# Altium schematic sheet Clocking_and_LO.SchDoc
size C; SheetNumber: 6; SheetTotal: 15
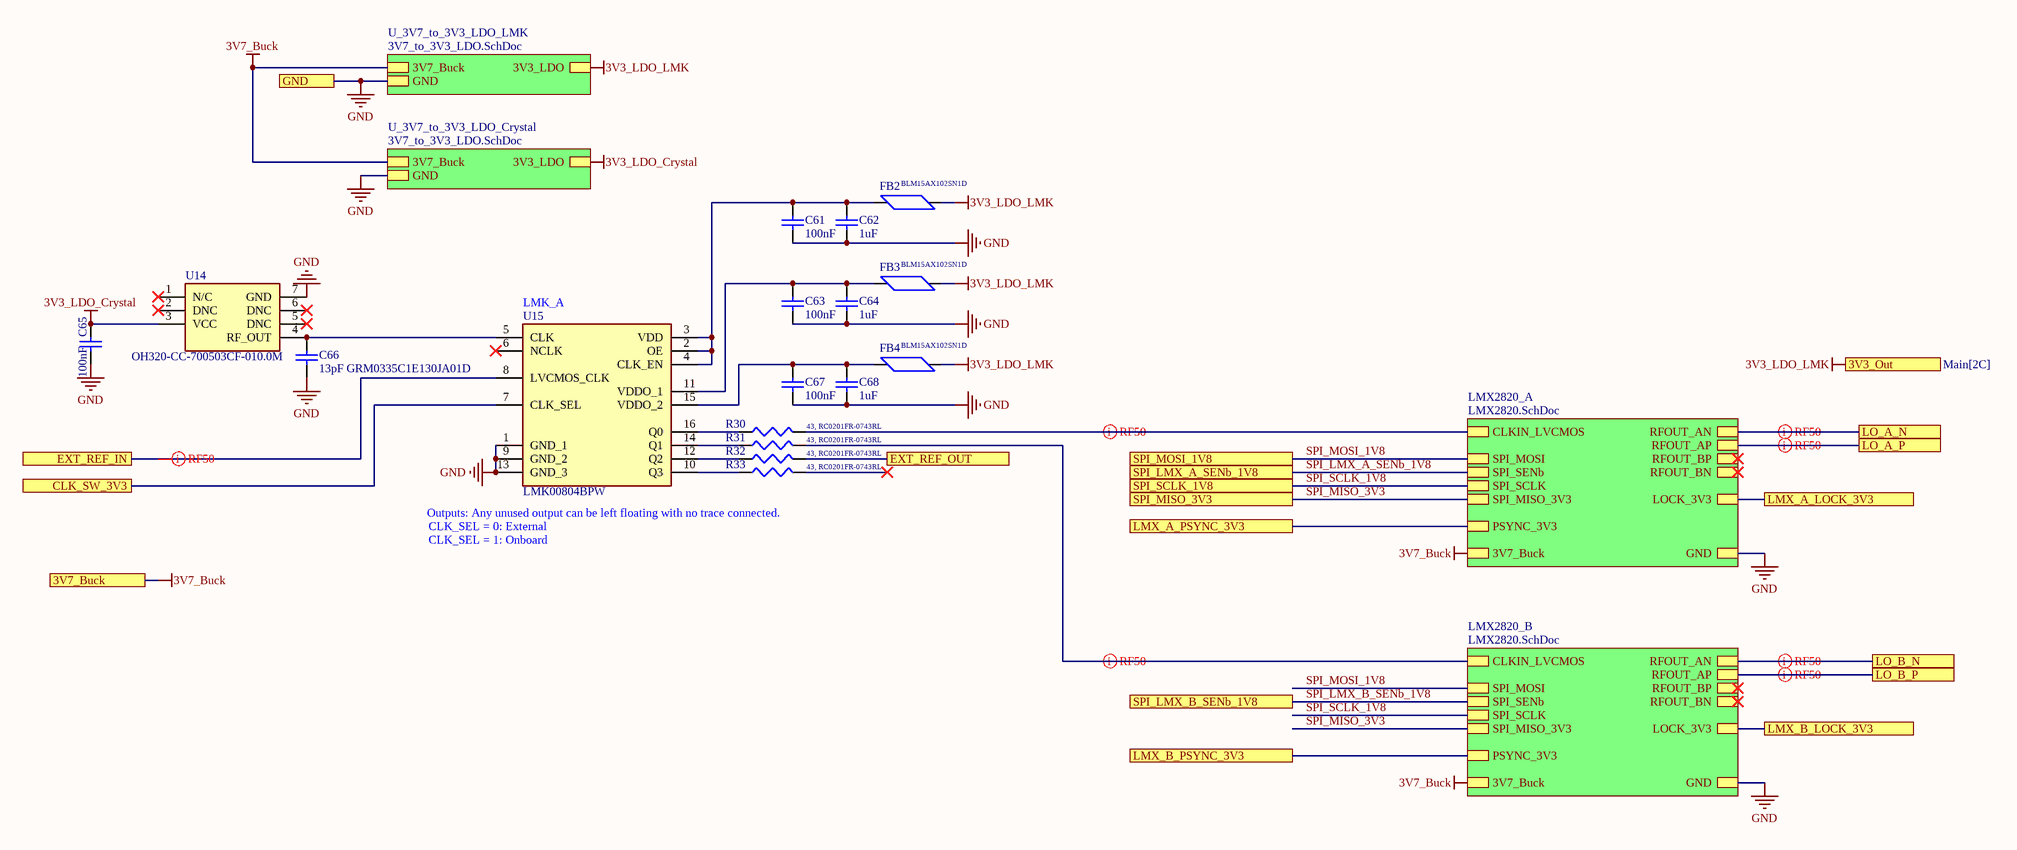
[diagram p0: Clocking_and_LO.SchDoc]

## Parts
C61  100nF  [SMD-0402]
C62  1uF  [SMD-0402]
C63  100nF  [SMD-0402]
C64  1uF  [SMD-0402]
C65  100nF  [SMD-0402]
C66  13pF GRM0335C1E130JA01D  [Johanson-0201]
C67  100nF  [SMD-0402]
C68  1uF  [SMD-0402]
FB2  BLM15AX102SN1D  [SMD-0402]
FB3  BLM15AX102SN1D  [SMD-0402]
FB4  BLM15AX102SN1D  [SMD-0402]
R30  43, RC0201FR-0743RL  [Johanson-0201]
R31  43, RC0201FR-0743RL  [Johanson-0201]
R32  43, RC0201FR-0743RL  [Johanson-0201]
R33  43, RC0201FR-0743RL  [Johanson-0201]
U14  OH320-CC-700503CF-010.0M  [OH320-CC-700503CF-010.0M]
U15  LMK00804BPW  [LMK00804]

## Sub-sheets
LMX2820_A = LMX2820.SchDoc: RFOUT_AP, GND, SPI_MOSI, SPI_SENb, SPI_SCLK, 3V7_Buck, RFOUT_AN, RFOUT_BN, RFOUT_BP, CLKIN_LVCMOS, SPI_MISO_3V3, LOCK_3V3, PSYNC_3V3
LMX2820_B = LMX2820.SchDoc: RFOUT_AP, GND, SPI_MOSI, SPI_SENb, SPI_SCLK, 3V7_Buck, RFOUT_AN, RFOUT_BN, RFOUT_BP, CLKIN_LVCMOS, SPI_MISO_3V3, LOCK_3V3, PSYNC_3V3
U_3V7_to_3V3_LDO_Crystal = 3V7_to_3V3_LDO.SchDoc: 3V7_Buck, GND, 3V3_LDO
U_3V7_to_3V3_LDO_LMK = 3V7_to_3V3_LDO.SchDoc: 3V7_Buck, GND, 3V3_LDO

## Ports
3V3_Out (see Main[2C]), 3V7_Buck (see Main[1B], 3V7_to_3V3_LDO[1A], LMX2820[3B]), CLK_SW_3V3 (see Main[1C]), EXT_REF_IN (see Main[1C]), EXT_REF_OUT (see Main[2C]), GND (see Main[2C], 3V7_to_3V3_LDO[1B], 5V5_to_5V0_LDO[1C], Buck_TPSM82913_1V8[3C], Buck_TPSM82913_3V7[3C], Buck_TPSM82913_5V0[3C], Buck_TPSM82913_5V5[2C], Fan_Interfaces[2B], IQ_Demod[1C], IQ_Mod[1B], LMX2820[4D], Microzed_Interfaces[1A], Power_Supply[6B], Voltage_Conv_Bidirectional[1B]), LMX_A_LOCK_3V3 (see Main[2C]), LMX_A_PSYNC_3V3 (see Main[1C]), LMX_B_LOCK_3V3 (see Main[2C]), LMX_B_PSYNC_3V3 (see Main[1C]), LO_A_N (see Main[2B]), LO_A_P (see Main[2B]), LO_B_N (see Main[2C]), LO_B_P (see Main[2C]), SPI_LMX_A_SENb_1V8 (see Main[1C], Microzed_Interfaces[4B]), SPI_LMX_B_SENb_1V8 (see Main[1C], Microzed_Interfaces[4A]), SPI_MISO_3V3 (see Main[1C], LMX2820[5B]), SPI_MOSI_1V8 (see Main[1C], Microzed_Interfaces[4D]), SPI_SCLK_1V8 (see Main[1C], Microzed_Interfaces[4D])

## Nets
3V3_LDO_Crystal: C65.2 U14.3(VCC) ; sheet U_3V7_to_3V3_LDO_Crystal/3V3_LDO
3V3_LDO_LMK: FB2.1 FB3.1 FB4.1 ; port 3V3_Out, sheet U_3V7_to_3V3_LDO_LMK/3V3_LDO
3V7_Buck: port 3V7_Buck, sheet LMX2820_A/3V7_Buck, sheet LMX2820_B/3V7_Buck, sheet U_3V7_to_3V3_LDO_LMK/3V7_Buck, sheet U_3V7_to_3V3_LDO_Crystal/3V7_Buck
GND: C61.2 C62.2 C63.2 C64.2 C65.1 C66.1 C67.2 C68.2 U14.7(GND) U15.1(GND_1) U15.9(GND_2) U15.13(GND_3) ; port GND, sheet LMX2820_A/GND, sheet LMX2820_B/GND, sheet U_3V7_to_3V3_LDO_LMK/GND, sheet U_3V7_to_3V3_LDO_Crystal/GND
CLK_SW_3V3: U15.7(CLK_SEL) ; port CLK_SW_3V3
EXT_REF_IN: U15.8(LVCMOS_CLK) ; port EXT_REF_IN
EXT_REF_OUT: R32.2 ; port EXT_REF_OUT
LMX_A_LOCK_3V3: port LMX_A_LOCK_3V3, sheet LMX2820_A/LOCK_3V3
LMX_A_PSYNC_3V3: port LMX_A_PSYNC_3V3, sheet LMX2820_A/PSYNC_3V3
LMX_B_LOCK_3V3: port LMX_B_LOCK_3V3, sheet LMX2820_B/LOCK_3V3
LMX_B_PSYNC_3V3: port LMX_B_PSYNC_3V3, sheet LMX2820_B/PSYNC_3V3
LO_A_N: port LO_A_N, sheet LMX2820_A/RFOUT_AN
LO_A_P: port LO_A_P, sheet LMX2820_A/RFOUT_AP
LO_B_N: port LO_B_N, sheet LMX2820_B/RFOUT_AN
LO_B_P: port LO_B_P, sheet LMX2820_B/RFOUT_AP
SPI_LMX_A_SENb_1V8: port SPI_LMX_A_SENb_1V8, sheet LMX2820_A/SPI_SENb
SPI_LMX_B_SENb_1V8: port SPI_LMX_B_SENb_1V8, sheet LMX2820_B/SPI_SENb
SPI_MISO_3V3: port SPI_MISO_3V3, sheet LMX2820_A/SPI_MISO_3V3, sheet LMX2820_B/SPI_MISO_3V3
SPI_MOSI_1V8: port SPI_MOSI_1V8, sheet LMX2820_A/SPI_MOSI, sheet LMX2820_B/SPI_MOSI
SPI_SCLK_1V8: port SPI_SCLK_1V8, sheet LMX2820_A/SPI_SCLK, sheet LMX2820_B/SPI_SCLK
NetC61_1: C61.1 C62.1 FB2.2 U15.2(OE) U15.3(VDD) U15.4(CLK_EN)
NetC63_1: C63.1 C64.1 FB3.2 U15.11(VDDO_1)
NetC66_2: C66.2 U14.4(RF_OUT) U15.5(CLK)
NetC67_1: C67.1 C68.1 FB4.2 U15.15(VDDO_2)
NetR30_1: R30.1 U15.16(Q0)
NetR30_2: R30.2 ; sheet LMX2820_A/CLKIN_LVCMOS
NetR31_1: R31.1 U15.14(Q1)
NetR31_2: R31.2 ; sheet LMX2820_B/CLKIN_LVCMOS
NetR32_1: R32.1 U15.12(Q2)
NetR33_1: R33.1 U15.10(Q3)

Not connected (* = marked no-connect by the designer): R33 2*; U14 1(N/C)* 2(DNC)* 5(DNC)* 6(DNC)*; U15 6(NCLK)*

## Layout directives
net class RF50: EXT_REF_IN, LO_A_N, LO_A_P, LO_B_N, LO_B_P, NetR30_2, NetR31_2

## Notes on the sheet
- (near U15) LMK_A
- Outputs: Any unused output can be left floating with no trace connected.
- (near U15) CLK_SEL = 0: External
- CLK_SEL = 1: Onboard

## Library data of the parts
C61-C65 C67 C68 = CAP0402: Ceramic Capacitor 0402
C66 = CAP0201: Capacitor 0201 Imperial
FB2-FB4 = FB0402: Ferrite Bead 0402
R30-R33 = RES0201: Resistor-0201
U14 = OH320-CC-700503CF-010.0M: Oven Controlled Crystal Oscillator; Manufacturer_Name: onsemi; Manufacturer_Part_Number: BAT54SLT1G; Datasheet Link: http://www.onsemi.com/pub/Collateral/BAT54SLT1-D.PDF; Height: 1.11mm; Mouser Part Number: 863-BAT54SLT1G; Mouser Price/Stock: https://www.mouser.co.uk/ProductDetail/onsemi/BAT54SLT1G?qs=vLkC5FC1VN9oCh8qaBIZiQ%3D%3D; Arrow Part Number: BAT54SLT1G; Arrow Price/Stock: https://www.arrow.com/en/products/bat54slt1g/on-semiconductor?region=nac
U15 = LMK00804BPW: Low Skew, 1-to-4 Multiplexed Differential/LVCMOS-to-LVCMOS/TTL Fanout Buffer; Manufacturer_Name: Texas Instruments; Geometry.Height: 1.2mm; Manufacturer_Part_Number: LMK00804BPW; Mouser Part Number: 595-LMK00804BPW; Mouser Price/Stock: https://www.mouser.co.uk/ProductDetail/Texas-Instruments/LMK00804BPW?qs=NRIcxvoDUtdlTidVPGucWg%3D%3D; Arrow Part Number: LMK00804BPW; Arrow Price/Stock: https://www.arrow.com/en/products/lmk00804bpw/texas-instruments?region=nac; Datasheet Link: http://www.ti.com/general/docs/lit/getliterature.tsp?genericPartNumber=LMK00804B&&fileType=pdf